# Altium schematic sheet Driver_Mosfet.SchDoc
size A4
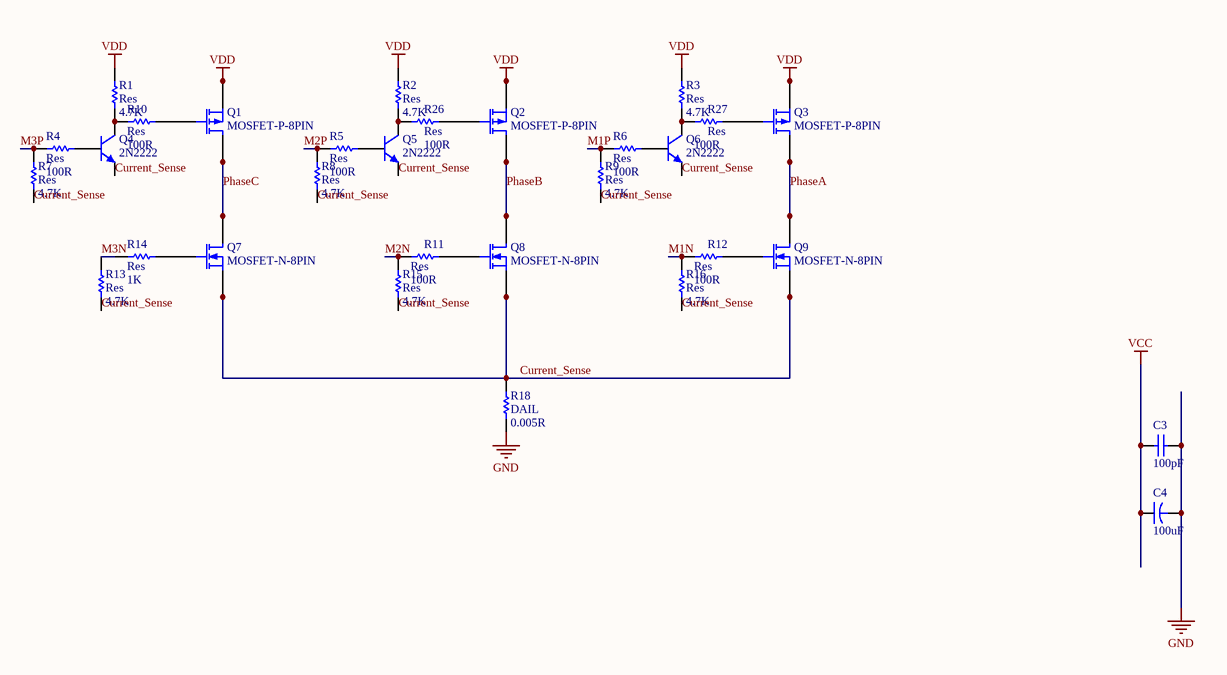
[diagram p0: Driver_Mosfet.SchDoc]

## Parts
C3  value 100pF  [2012[0805]]  (hidden comment: Cap_UP)
C4  value 100uF  [7343]  (hidden comment: Cap_El)
Q1  MOSFET-P-8PIN  [SO-8_N]
Q2  MOSFET-P-8PIN  [SO-8_N]
Q3  MOSFET-P-8PIN  [SO-8_N]
Q4  2N2222  [SOT-23]
Q5  2N2222  [SOT-23]
Q6  2N2222  [SOT-23]
Q7  MOSFET-N-8PIN  [SO-8_N]
Q8  MOSFET-N-8PIN  [SO-8_N]
Q9  MOSFET-N-8PIN  [SO-8_N]
R1  Res  value 4.7K  [2012[0805]]
R2  Res  value 4.7K  [2012[0805]]
R3  Res  value 4.7K  [2012[0805]]
R4  Res  value 100R  [2012[0805]]
R5  Res  value 100R  [2012[0805]]
R6  Res  value 100R  [2012[0805]]
R7  Res  value 4.7K  [2012[0805]]
R8  Res  value 4.7K  [2012[0805]]
R9  Res  value 4.7K  [2012[0805]]
R10  Res  value 100R  [2012[0805]]
R11  Res  value 100R  [2012[0805]]
R12  Res  value 100R  [2012[0805]]
R13  Res  value 4.7K  [2012[0805]]
R14  Res  value 1K  [2012[0805]]
R15  Res  value 4.7K  [2012[0805]]
R16  Res  value 4.7K  [2012[0805]]
R18  DAIL  value 0.005R  [6332[2512]]
R26  Res  value 100R  [2012[0805]]
R27  Res  value 100R  [2012[0805]]

## Nets
GND: C3.2 C4.2 R18.1
VCC: C3.1 C4.1
VDD: Q1.1(S) Q1.2(S) Q1.3(S) Q2.1(S) Q2.2(S) Q2.3(S) Q3.1(S) Q3.2(S) Q3.3(S) R1.2 R2.2 R3.2
Current_Sense: Q4.3(E) Q5.3(E) Q6.3(E) Q7.1(S) Q7.2(S) Q7.3(S) Q8.1(S) Q8.2(S) Q8.3(S) Q9.1(S) Q9.2(S) Q9.3(S) R7.1 R8.1 R9.1 R13.1 R15.1 R16.1 R18.2
M1N: R12.1 R16.2
M1P: R6.2 R9.2
M2N: R11.1 R15.2
M2P: R5.2 R8.2
M3N: R13.2 R14.1
M3P: R4.2 R7.2
PhaseA: Q3.5(D) Q3.6(D) Q3.7(D) Q3.8(D) Q9.5(D) Q9.6(D) Q9.7(D) Q9.8(D)
PhaseB: Q2.5(D) Q2.6(D) Q2.7(D) Q2.8(D) Q8.5(D) Q8.6(D) Q8.7(D) Q8.8(D)
PhaseC: Q1.5(D) Q1.6(D) Q1.7(D) Q1.8(D) Q7.5(D) Q7.6(D) Q7.7(D) Q7.8(D)
NetQ1_4: Q1.4(G) R10.2
NetQ2_4: Q2.4(G) R26.2
NetQ3_4: Q3.4(G) R27.2
NetQ4_1: Q4.1(C) R1.1 R10.1
NetQ4_2: Q4.2(B) R4.1
NetQ5_1: Q5.1(C) R2.1 R26.1
NetQ5_2: Q5.2(B) R5.1
NetQ6_1: Q6.1(C) R3.1 R27.1
NetQ6_2: Q6.2(B) R6.1
NetQ7_4: Q7.4(G) R14.2
NetQ8_4: Q8.4(G) R11.2
NetQ9_4: Q9.4(G) R12.2

## Library data of the parts
C3 = Cap_UP: Capacitor; Published: 8-Jun-2000; LatestRevisionDate: 17-Jul-2002; LatestRevisionNote: Re-released for DXP Platform.; PackageReference: RAD-0.3; Publisher: Altium Limited
C4 = Cap_El: Capacitor; Published: 23-Sep-2002; PackageReference: CAPR5-4X5; Publisher: Altium Limited
Q1-Q3 = MOSFET-P-8PIN: P-Channel MOSFET; PackageDocument: 1995/1996; Published: 8-Jun-2000; LatestRevisionDate: 17-Jul-2002; LatestRevisionNote: Re-released for DXP Platform.; PackageReference: E3; Publisher: Altium Limited
Q4-Q6 = 2N2222: NPN Bipolar Transistor; Published: 8-Jun-2000; LatestRevisionDate: 17-Jul-2002; LatestRevisionNote: Re-released for DXP Platform.; PackageReference: TO-226; Publisher: Altium Limited; Code_JEDEC: TO-226-AA
Q7-Q9 = MOSFET-N-8PIN: N-Channel MOSFET; PackageDocument: 1995/1996; Published: 8-Jun-2000; LatestRevisionDate: 17-Jul-2002; LatestRevisionNote: Re-released for DXP Platform.; PackageReference: E3; Publisher: Altium Limited
R1-R16 R18 R26 R27 = Res: Semiconductor Resistor; Published: 8-Jun-2000; LatestRevisionDate: 17-Jul-2002; LatestRevisionNote: Re-released for DXP Platform.; PackageReference: AXIAL-0.5; Publisher: Altium Limited